# EAGLE schematic breakout (EAGLE 9.6.2)
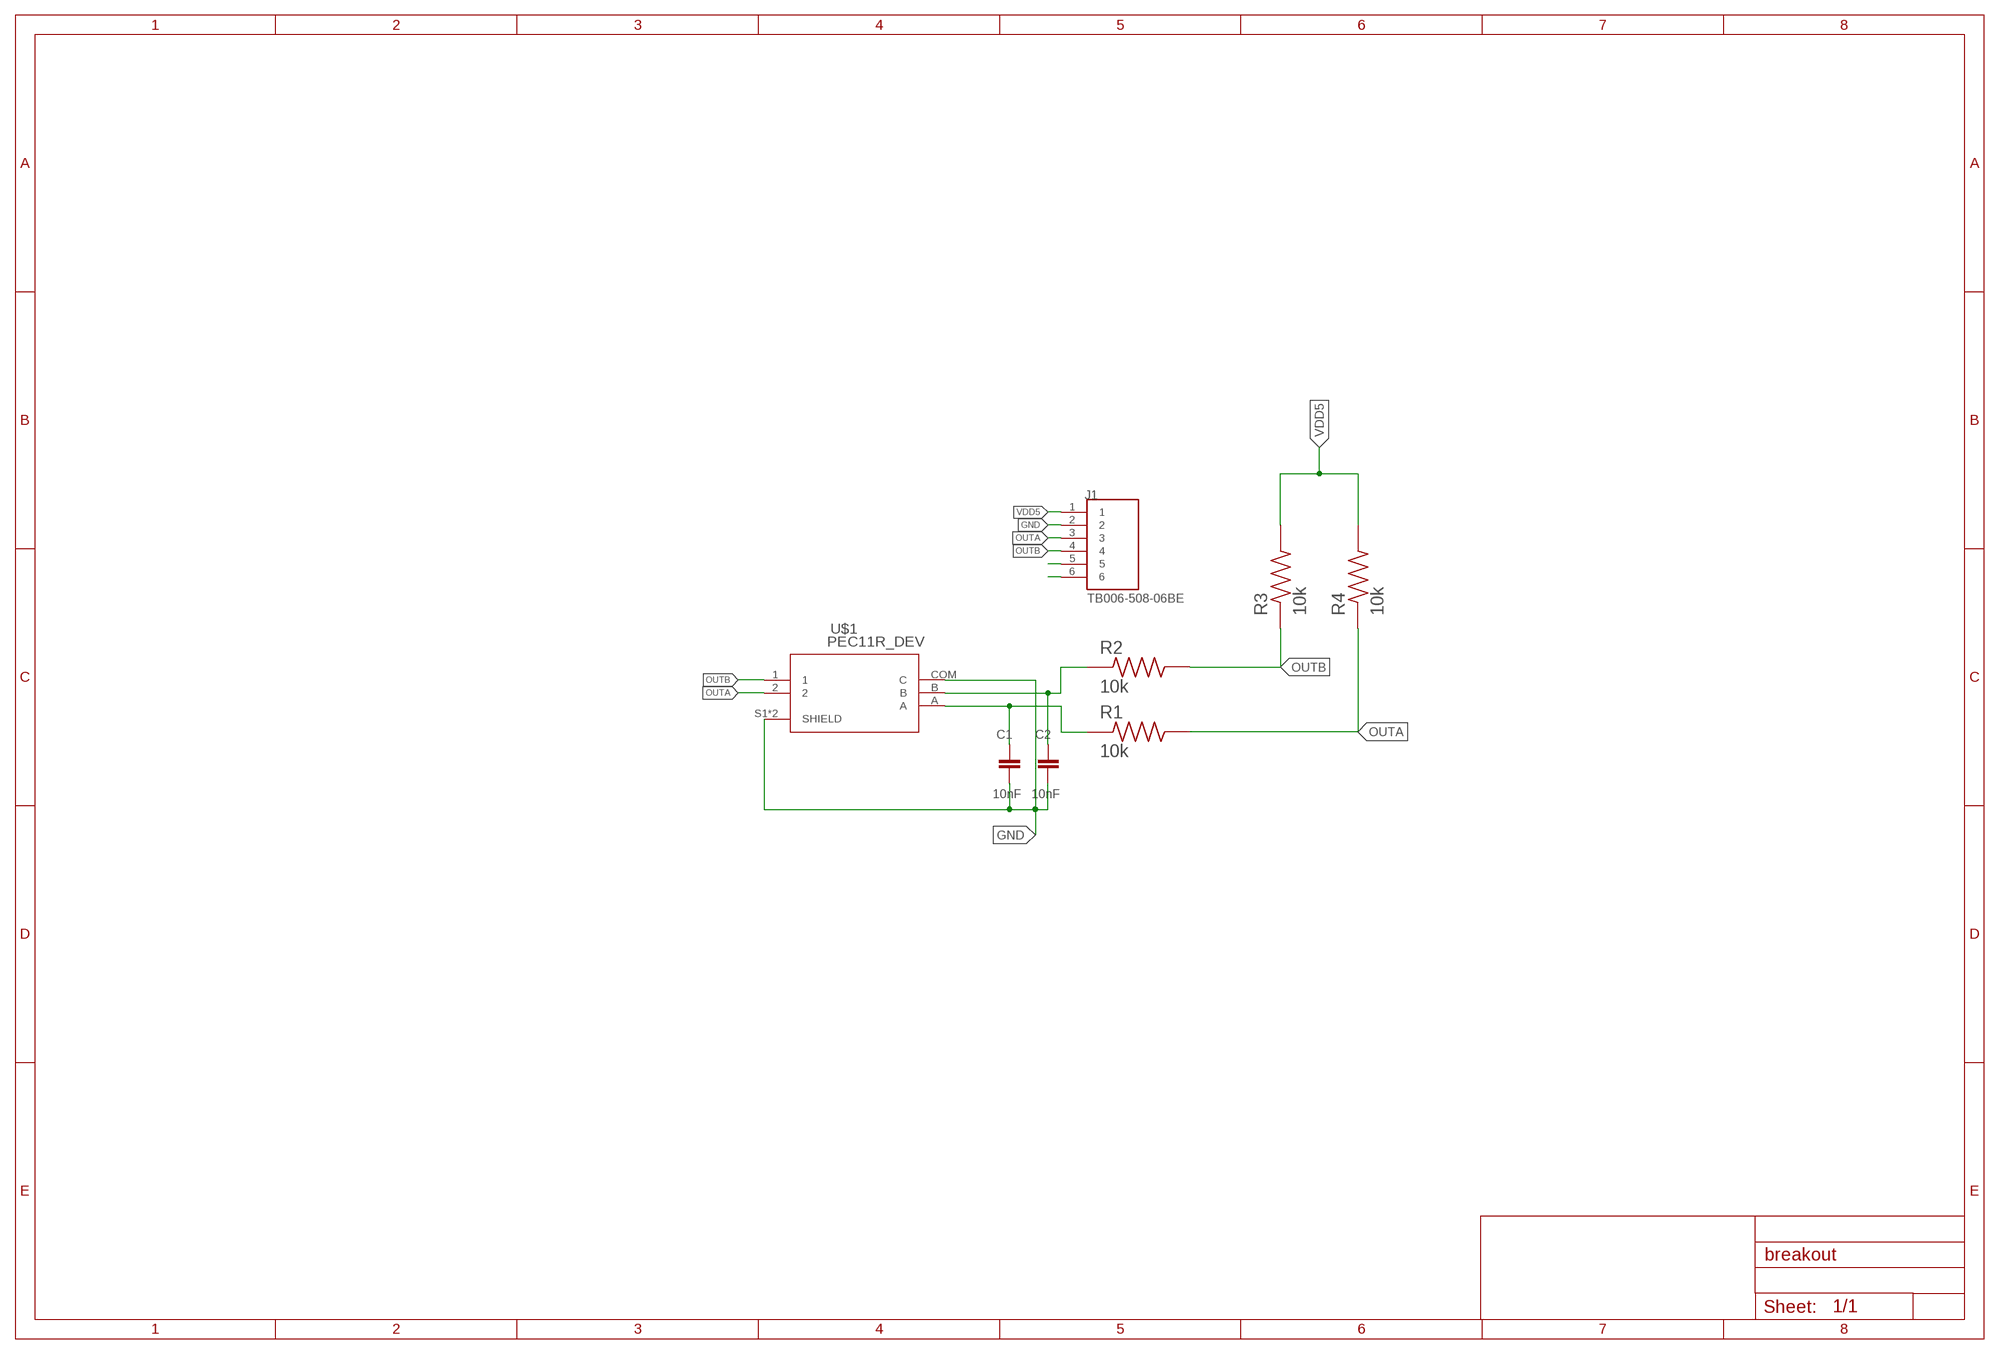
[diagram p0: schematic, sheet 1]

## Parts
C1  10nF  GRM31CR60J107ME39L  [CAP_1206]
C2  10nF  GRM31CR60J107ME39L  [CAP_1206]
J1  TB006-508-06BE  [CUI_TB006-508-06BE]
R1  10k  CRGP1206F120R  [RESC3115X65N]
R2  10k  CRGP1206F120R  [RESC3115X65N]
R3  10k  CRGP1206F120R  [RESC3115X65N]
R4  10k  CRGP1206F120R  [RESC3115X65N]
U$1  PEC11R_DEV  [PEC11R_S_FP]

## Nets
GND: C1.2 C2.2 J1.2 U$1.COM(C) U$1.S1(SHIELD) U$1.S2(SHIELD)
N$1: C2.1 R2.1 U$1.B
N$2: C1.1 R1.1 U$1.A
N$8: J1.6
OUTA: J1.3 R1.2 R4.1 U$1.2
OUTB: J1.4 R2.2 R3.1 U$1.1
VDD5: J1.1 J1.5 R3.2 R4.2

## Library data of the parts
C1 C2 = Resistor_Capacitor:GRM31CR60J107ME39L: CAP CER 100UF 6.3V X5R 1206 Manufacturer's datasheet <https://www.murata.com/~/media/webrenewal/support/library/catalog/products/capacitor/mlcc/c02e.ashx?la=en-us>; CREATED_BY: PCBLayout.com; DIGIKEY_PART_NUMBER: GRM31CR60J107ME39L; MANUFACTURER: Murata Electronics North America; MPN: GRM31CR60J107ME39L; PACKAGE: SMD 1206
J1 = TB006-508-06BE:TB006-508-06BE: Check prices <https://pricing.snapeda.com/parts/TB006-508-06BE/CUI%20Devices/view-part?ref=eda>; AVAILABILITY: Good; CUI_PURCHASE_URL: https://www.cuidevices.com/product/interconnect/connectors/terminal-blocks/tb006-508-series?utm_source=snapeda.com&utm_medium=referral&utm_campaign=snapedaBOM; DESCRIPTION: 2~24 Poles, Screw Type, Horizontal, 5.08 Pitch, 26~14 (AWG), Terminal Block Connector; MF: CUI Devices; MP: TB006-508-06BE; PACKAGE: None; PRICE: None; PURCHASE-URL: https://pricing.snapeda.com/search/part/TB006-508-06BE/?ref=eda
R1-R4 = CRGP1206F120R:CRGP1206F120R: Fixed Resistor CRGP 1206 120R 1%; ARROW_ELECTRONICS-PURCHASE-URL: https://snapeda.com/shop?store=Arrow+Electronics&id=3188205; AVAILABILITY: Unavailable; COMMENT: 1-2176328-4; DESCRIPTION: Fixed Resistor CRGP 1206 120R 1%; DIGIKEY-PURCHASE-URL: https://snapeda.com/shop?store=DigiKey&id=3188205; MF: TE Connectivity; MOUSER-PURCHASE-URL: https://snapeda.com/shop?store=Mouser&id=3188205; MP: CRGP1206F120R; PACKAGE: 3115 TE Connectivity; PRICE: None
U$1 = PEC11R-sym:PEC11R_DEV